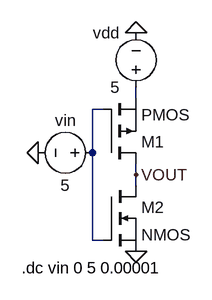
[diagram p0: schematic lab3-electronics.asc]
lab3-electronics.asc, the LTspice schematic file:
Version 4.1
SHEET 1 880 680
WIRE 224 32 224 16
WIRE 176 48 160 48
WIRE 160 112 160 48
WIRE 224 144 224 128
WIRE 224 160 224 144
WIRE 160 240 160 112
WIRE 176 240 160 240
FLAG 224 256 0
FLAG 80 112 0
FLAG 224 -64 0
FLAG 224 144 VOUT
SYMBOL pmos 176 128 M180
SYMATTR InstName M1
SYMBOL nmos 176 160 R0
SYMATTR InstName M2
SYMBOL voltage 224 32 R180
WINDOW 0 24 96 Left 2
WINDOW 3 24 16 Left 2
WINDOW 123 0 0 Left 0
WINDOW 39 0 0 Left 0
SYMATTR InstName vdd
SYMATTR Value 5
SYMBOL voltage 176 112 R90
WINDOW 0 -32 56 VBottom 2
WINDOW 3 32 56 VTop 2
WINDOW 123 0 0 Left 0
WINDOW 39 0 0 Left 0
SYMATTR InstName vin
SYMATTR Value 5
TEXT 56 280 Left 2 !.dc vin 0 5 0.00001

The netlist it stands for:
* lab3-electronics.asc
M1 VOUT N002 N001 N001 PMOS
M2 VOUT N002 0 0 NMOS
vdd N001 0 5
vin N002 0 5
.model NMOS NMOS
.model PMOS PMOS
.lib standard.mos
.dc vin 0 5 0.00001
.backanno
.end